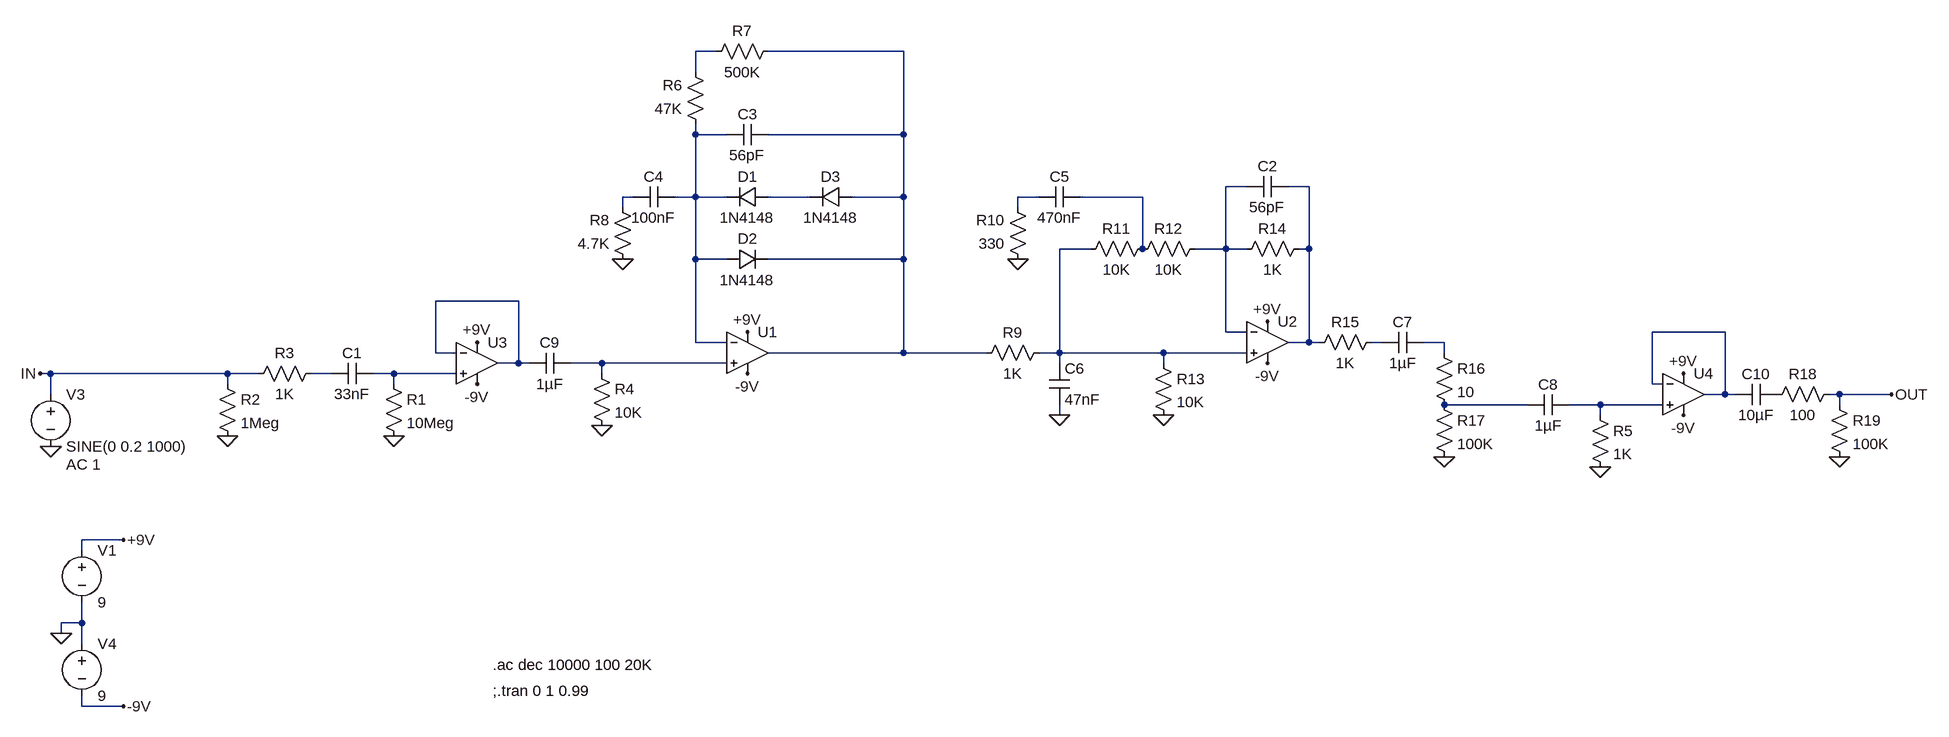
[diagram p0: schematic plumes_sim.asc]
plumes_sim.asc, the LTspice schematic file:
Version 4.1
SHEET 1 2708 716
WIRE 608 -352 576 -352
WIRE 896 -352 688 -352
WIRE 576 -320 576 -352
WIRE 576 -224 576 -240
WIRE 624 -224 576 -224
WIRE 896 -224 896 -352
WIRE 896 -224 688 -224
WIRE 1424 -144 1392 -144
WIRE 1520 -144 1488 -144
WIRE 480 -128 464 -128
WIRE 576 -128 576 -224
WIRE 576 -128 544 -128
WIRE 624 -128 576 -128
WIRE 752 -128 688 -128
WIRE 896 -128 896 -224
WIRE 896 -128 816 -128
WIRE 1104 -128 1072 -128
WIRE 1264 -128 1168 -128
WIRE 464 -112 464 -128
WIRE 1072 -112 1072 -128
WIRE 1184 -48 1136 -48
WIRE 1264 -48 1264 -128
WIRE 1392 -48 1392 -144
WIRE 1392 -48 1344 -48
WIRE 1424 -48 1392 -48
WIRE 1520 -48 1520 -144
WIRE 1520 -48 1504 -48
WIRE 576 -32 576 -128
WIRE 624 -32 576 -32
WIRE 896 -32 896 -128
WIRE 896 -32 688 -32
WIRE 304 32 176 32
WIRE 1392 80 1392 -48
WIRE 1424 80 1392 80
WIRE 2160 80 2048 80
WIRE 576 96 576 -32
WIRE 624 96 576 96
WIRE 1520 96 1520 -48
WIRE 1520 96 1488 96
WIRE 1536 96 1520 96
WIRE 1632 96 1616 96
WIRE 1728 96 1696 96
WIRE 176 112 176 32
WIRE 208 112 176 112
WIRE 896 112 896 -32
WIRE 896 112 688 112
WIRE 1024 112 896 112
WIRE 1136 112 1136 -48
WIRE 1136 112 1104 112
WIRE 1296 112 1136 112
WIRE 1424 112 1296 112
WIRE 1728 112 1728 96
WIRE 304 128 304 32
WIRE 304 128 272 128
WIRE 320 128 304 128
WIRE 432 128 384 128
WIRE 624 128 432 128
WIRE 1136 128 1136 112
WIRE 1296 128 1296 112
WIRE -416 144 -432 144
WIRE -144 144 -416 144
WIRE -96 144 -144 144
WIRE 16 144 -16 144
WIRE 112 144 80 144
WIRE 208 144 112 144
WIRE 432 144 432 128
WIRE -144 160 -144 144
WIRE 112 160 112 144
WIRE 2048 160 2048 80
WIRE 2064 160 2048 160
WIRE -416 176 -416 144
WIRE 2160 176 2160 80
WIRE 2160 176 2128 176
WIRE 2176 176 2160 176
WIRE 2336 176 2320 176
WIRE 2416 176 2336 176
WIRE 1856 192 1728 192
WIRE 1968 192 1920 192
WIRE 2064 192 1968 192
WIRE 2336 192 2336 176
WIRE 1136 208 1136 192
WIRE 1968 208 1968 192
WIRE -304 400 -368 400
WIRE -368 416 -368 400
WIRE -368 528 -368 496
WIRE -368 528 -400 528
WIRE -400 544 -400 528
WIRE -368 560 -368 528
WIRE -368 656 -368 640
WIRE -304 656 -368 656
FLAG -304 400 +9V
FLAG -416 256 0
FLAG -432 144 IN
FLAG 464 -32 0
FLAG 656 80 +9V
FLAG 1136 208 0
FLAG 1456 64 +9V
FLAG 1728 272 0
FLAG -144 240 0
FLAG 112 240 0
FLAG 240 96 +9V
FLAG -400 544 0
FLAG -304 656 -9V
FLAG 240 160 -9V
FLAG 432 224 0
FLAG 1296 208 0
FLAG 1968 288 0
FLAG 656 144 -9V
FLAG 1456 128 -9V
FLAG 2096 208 -9V
FLAG 2096 144 +9V
FLAG 2336 272 0
FLAG 2416 176 OUT
FLAG 1072 -32 0
SYMBOL voltage -368 400 R0
WINDOW 123 0 0 Left 0
WINDOW 39 0 0 Left 0
SYMATTR InstName V1
SYMATTR Value 9
SYMBOL voltage -416 160 R0
WINDOW 123 24 124 Left 2
WINDOW 39 0 0 Left 0
SYMATTR InstName V3
SYMATTR Value SINE(0 0.2 1000)
SYMATTR Value2 AC 1
SYMBOL diode 688 -144 R90
WINDOW 0 0 32 VBottom 2
WINDOW 3 32 32 VTop 2
SYMATTR InstName D1
SYMATTR Value 1N4148
SYMBOL diode 624 -16 R270
WINDOW 0 32 32 VTop 2
WINDOW 3 0 32 VBottom 2
SYMATTR InstName D2
SYMATTR Value 1N4148
SYMBOL cap 688 -240 R90
WINDOW 0 0 32 VBottom 2
WINDOW 3 32 32 VTop 2
SYMATTR InstName C3
SYMATTR Value 56pF
SYMBOL res 592 -224 R180
WINDOW 0 36 76 Left 2
WINDOW 3 36 40 Left 2
SYMATTR InstName R6
SYMATTR Value 47K
SYMBOL res 704 -368 R90
WINDOW 0 0 56 VBottom 2
WINDOW 3 32 56 VTop 2
SYMATTR InstName R7
SYMATTR Value 500K
SYMBOL cap 544 -144 R90
WINDOW 0 0 32 VBottom 2
WINDOW 3 32 32 VTop 2
SYMATTR InstName C4
SYMATTR Value 100nF
SYMBOL res 480 -16 R180
WINDOW 0 36 76 Left 2
WINDOW 3 36 40 Left 2
SYMATTR InstName R8
SYMATTR Value 4.7K
SYMBOL res 1120 96 R90
WINDOW 0 0 56 VBottom 2
WINDOW 3 32 56 VTop 2
SYMATTR InstName R9
SYMATTR Value 1K
SYMBOL cap 1168 -144 R90
WINDOW 0 0 32 VBottom 2
WINDOW 3 32 32 VTop 2
SYMATTR InstName C5
SYMATTR Value 470nF
SYMBOL res 1280 -64 R90
WINDOW 0 0 56 VBottom 2
WINDOW 3 32 56 VTop 2
SYMATTR InstName R11
SYMATTR Value 10K
SYMBOL res 1360 -64 R90
WINDOW 0 0 56 VBottom 2
WINDOW 3 32 56 VTop 2
SYMATTR InstName R12
SYMATTR Value 10K
SYMBOL cap 1120 128 R0
SYMATTR InstName C6
SYMATTR Value 47nF
SYMBOL res 1280 112 R0
SYMATTR InstName R13
SYMATTR Value 10K
SYMBOL res 1520 -64 R90
WINDOW 0 0 56 VBottom 2
WINDOW 3 32 56 VTop 2
SYMATTR InstName R14
SYMATTR Value 1K
SYMBOL res 1632 80 R90
WINDOW 0 0 56 VBottom 2
WINDOW 3 32 56 VTop 2
SYMATTR InstName R15
SYMATTR Value 1K
SYMBOL res 1712 96 R0
SYMATTR InstName R16
SYMATTR Value 10
SYMBOL res 1712 176 R0
SYMATTR InstName R17
SYMATTR Value 100K
SYMBOL cap 1920 176 R90
WINDOW 0 0 32 VBottom 2
WINDOW 3 32 32 VTop 2
SYMATTR InstName C8
SYMATTR Value 1µF
SYMBOL OpAmps\\UniversalOpAmp2 656 112 R0
SYMATTR InstName U1
SYMBOL OpAmps\\UniversalOpAmp2 1456 96 R0
SYMATTR InstName U2
SYMBOL OpAmps\\UniversalOpAmp2 240 128 R0
SYMATTR InstName U3
SYMBOL res 96 144 R0
SYMATTR InstName R1
SYMATTR Value 10Meg
SYMBOL res -160 144 R0
SYMATTR InstName R2
SYMATTR Value 1Meg
SYMBOL res 0 128 R90
WINDOW 0 0 56 VBottom 2
WINDOW 3 32 56 VTop 2
SYMATTR InstName R3
SYMATTR Value 1K
SYMBOL cap 80 128 R90
WINDOW 0 0 32 VBottom 2
WINDOW 3 32 32 VTop 2
SYMATTR InstName C1
SYMATTR Value 33nF
SYMBOL voltage -368 544 R0
WINDOW 123 0 0 Left 0
WINDOW 39 0 0 Left 0
SYMATTR InstName V4
SYMATTR Value 9
SYMBOL cap 384 112 R90
WINDOW 0 0 32 VBottom 2
WINDOW 3 32 32 VTop 2
SYMATTR InstName C9
SYMATTR Value 1µF
SYMBOL res 416 128 R0
SYMATTR InstName R4
SYMATTR Value 10K
SYMBOL cap 1488 -160 R90
WINDOW 0 0 32 VBottom 2
WINDOW 3 32 32 VTop 2
SYMATTR InstName C2
SYMATTR Value 56pF
SYMBOL cap 1696 80 R90
WINDOW 0 0 32 VBottom 2
WINDOW 3 32 32 VTop 2
SYMATTR InstName C7
SYMATTR Value 1µF
SYMBOL res 1952 192 R0
SYMATTR InstName R5
SYMATTR Value 1K
SYMBOL OpAmps\\UniversalOpAmp2 2096 176 R0
SYMATTR InstName U4
SYMBOL cap 2240 160 R90
WINDOW 0 0 32 VBottom 2
WINDOW 3 32 32 VTop 2
SYMATTR InstName C10
SYMATTR Value 10µF
SYMBOL res 2336 160 R90
WINDOW 0 0 56 VBottom 2
WINDOW 3 32 56 VTop 2
SYMATTR InstName R18
SYMATTR Value 100
SYMBOL res 2320 176 R0
SYMATTR InstName R19
SYMATTR Value 100K
SYMBOL diode 816 -144 R90
WINDOW 0 0 32 VBottom 2
WINDOW 3 32 32 VTop 2
SYMATTR InstName D3
SYMATTR Value 1N4148
SYMBOL res 1088 -16 R180
WINDOW 0 36 76 Left 2
WINDOW 3 36 40 Left 2
SYMATTR InstName R10
SYMATTR Value 330
TEXT 264 632 Left 2 !;.tran 0 1 0.99
TEXT 264 592 Left 2 !.ac dec 10000 100 20K

The netlist it stands for:
* plumes_sim.asc
V1 +9V 0 9
V3 IN 0 SINE(0 0.2 1000) AC 1
D1 N007 N003 1N4148
D2 N003 N002 1N4148
C3 N002 N003 56pF
R6 N003 N001 47K
R7 N002 N001 500K
C4 N003 N006 100nF
R8 0 N006 4.7K
R9 N010 N002 1K
C5 N009 N008 470nF
R11 N009 N010 10K
R12 N004 N009 10K
C6 N010 0 47nF
R13 N010 0 10K
R14 N005 N004 1K
R15 N013 N005 1K
R16 N014 N018 10
R17 N018 0 100K
C8 N019 N018 1µF
X§U1 N015 N003 +9V -9V N002 level2 Avol=1Meg GBW=10Meg Slew=10Meg Ilimit=25m Rail=0 Vos=0 En=0 Enk=0 In=0 Ink=0 Rin=500Meg  ; pins In+ In- V+ V- OUT
X§U2 N010 N004 +9V -9V N005 level2 Avol=1Meg GBW=10Meg Slew=10Meg Ilimit=25m Rail=0 Vos=0 En=0 Enk=0 In=0 Ink=0 Rin=500Meg  ; pins In+ In- V+ V- OUT
X§U3 N017 N011 +9V -9V N011 level2 Avol=1Meg GBW=10Meg Slew=10Meg Ilimit=25m Rail=0 Vos=0 En=0 Enk=0 In=0 Ink=0 Rin=500Meg  ; pins In+ In- V+ V- OUT
R1 N017 0 10Meg
R2 IN 0 1Meg
R3 N016 IN 1K
C1 N017 N016 33nF
V4 0 -9V 9
C9 N015 N011 1µF
R4 N015 0 10K
C2 N005 N004 56pF
C7 N014 N013 1µF
R5 N019 0 1K
X§U4 N019 N012 +9V -9V N012 level2 Avol=1Meg GBW=10Meg Slew=10Meg Ilimit=25m Rail=0 Vos=0 En=0 Enk=0 In=0 Ink=0 Rin=500Meg  ; pins In+ In- V+ V- OUT
C10 P001 N012 10µF
R18 OUT P001 100
R19 OUT 0 100K
D3 N002 N007 1N4148
R10 0 N008 330
.model D D
.lib standard.dio
;.tran 0 1 0.99
.ac dec 10000 100 20K
.lib UniversalOpAmp2.lib
.backanno
.end

* Results of the author's LTspice run, read from the files saved beside the schematic
* Operating Point, zero values left out:
*   V(+9v) = 9 V
*   V(-9v) = -9 V
*   I(V1) = -3.599 mA
*   I(V4) = -3.599 mA